# EAGLE design tempcontrol (EAGLE 6.4)
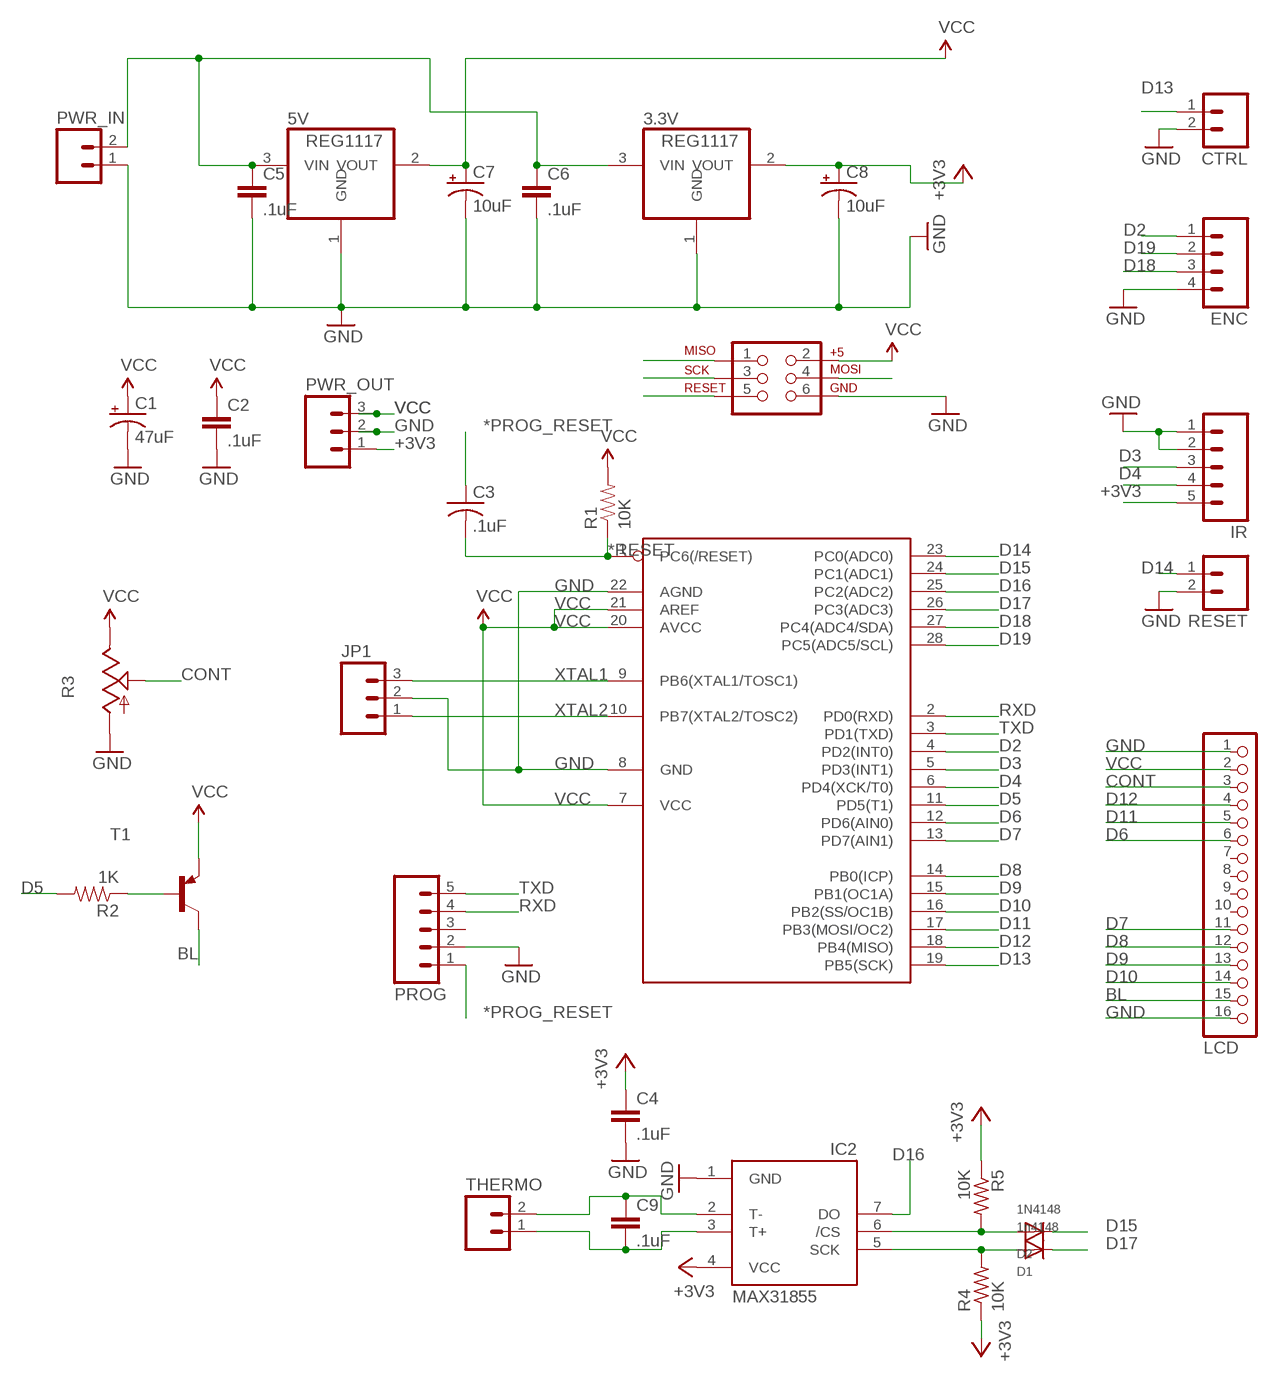
[diagram p0: schematic, sheet 1]

## Parts
3.3V  REG1117  [SOT223]
5V  REG1117  [SOT223]
C1  47uF  CAP_POLPTH2  [CPOL-RADIAL-10UF-25V]
C2  .1uF  CAP0805  [0805]
C3  .1uF  C-USC0805  [C0805]
C4  .1uF  CAP0805  [0805]
C5  .1uF  CAP0805  [0805]
C6  .1uF  CAP0805  [0805]
C7  10uF  CAP_POL3528  [EIA3528]
C8  10uF  CAP_POL3528  [EIA3528]
C9  .1uF  CAP0805  [0805]
CTRL  M02LOCK  [1X02_LOCK]
D1  1n4148  DIODESOD-323F  [SOD-323F]
D2  1N4148  DIODESOD-323F  [SOD-323F]
ENC  M04LOCK  [1X04_LOCK]
IC1  MEGA8-P  [DIL28-3]
IC2  MAX31855  MAX6675  [SO08]
IR  M05LOCK  [1X05_LOCK]
JP1  M03LOCK  [1X03_LOCK]
JP7  LCD  PINHD-1X16  [1X16]
PROG  PROG  M05LOCK  [1X05_LOCK]
PWR_IN  M02LOCK  [1X02_LOCK]
PWR_OUT  M03LOCK  [1X03_LOCK]
R1  10K  RESISTOR0805-RES  [0805]
R2  1K  RESISTOR0805-RES  [0805]
R3  TRIM_US-B64Y  [B64Y]
R4  10K  R-US_R0805  [R0805]
R5  10K  R-US_R0805  [R0805]
RESET  M02LOCK  [1X02_LOCK]
T1  2N3906-PNP-TO92-EBC  [TO92-EBC]
THERMO  M02LOCK  [1X02_LOCK]
U$1  AVR_SPI_PRG_6NS  [2X3-NS]

## Nets
*PROG_RESET: C3.1 PROG.1
*RESET: C3.2 IC1.1(PC6(/RESET)) R1.1 U$1.5
+3V3: 3.3V.2(VOUT) C4.1 C8.A(+) IC2.4(VCC) IR.5 PWR_OUT.1 R4.1 R5.1
BL: JP7.15 T1.C
CONT: JP7.3 R3.S
CS: D2.A IC2.6(/CS) R5.2
D2: ENC.1 IC1.4(PD2(INT0))
D3: IC1.5(PD3(INT1)) IR.3
D4: IC1.6(PD4(XCK/T0)) IR.4
D5: IC1.11(PD5(T1)) R2.2
D6: IC1.12(PD6(AIN0)) JP7.6
D7: IC1.13(PD7(AIN1)) JP7.11
D8: IC1.14(PB0(ICP)) JP7.12
D9: IC1.15(PB1(OC1A)) JP7.13
D10: IC1.16(PB2(SS/OC1B)) JP7.14
D11: IC1.17(PB3(MOSI/OC2)) JP7.5 U$1.4
D12: IC1.18(PB4(MISO)) JP7.4 U$1.1
D13: CTRL.1 IC1.19(PB5(SCK)) U$1.3
D14: IC1.23(PC0(ADC0)) RESET.1
D15: D2.C IC1.24(PC1(ADC1))
D16: IC1.25(PC2(ADC2)) IC2.7(DO)
D17: D1.C IC1.26(PC3(ADC3))
D18: ENC.3 IC1.27(PC4(ADC4/SDA))
D19: ENC.2 IC1.28(PC5(ADC5/SCL))
GND: 3.3V.1(GND) 5V.1(GND) C1.2(-) C2.2 C4.2 C5.2 C6.2 C7.C(-) C8.C(-) CTRL.2 ENC.4 IC1.8(GND) IC1.22(AGND) IC2.1(GND) IR.1 IR.2 JP1.2 JP7.1 JP7.16 PROG.2 PWR_IN.1 PWR_OUT.2 R3.A RESET.2 U$1.6
N$7: R2.1 T1.B
POS_IN: 3.3V.3(VIN) 5V.3(VIN) C5.1 C6.1 PWR_IN.2
RXD: IC1.2(PD0(RXD)) PROG.4
SCK: D1.A IC2.5(SCK) R4.2
T+: C9.2 IC2.3(T+) THERMO.1
T-: C9.1 IC2.2(T-) THERMO.2
TXD: IC1.3(PD1(TXD)) PROG.5
VCC: 5V.2(VOUT) C1.1(+) C2.1 C7.A(+) IC1.7(VCC) IC1.20(AVCC) IC1.21(AREF) JP7.2 PWR_OUT.3 R1.2 R3.E T1.E U$1.2
XTAL1: IC1.9(PB6(XTAL1/TOSC1)) JP1.3
XTAL2: IC1.10(PB7(XTAL2/TOSC2)) JP1.1
Unconnected: JP7.7 JP7.8 JP7.9 JP7.10 PROG.3

## Library data of the parts
3.3V 5V = mylib:REG1117: 800mA and 1A Low Dropout (LDO) Positive Regulator 1.8V, 2.5V, 2.85V, 3.3V, 5V, and Adj
C1 C7 C8 = SparkFun:CAP_POL: Capacitor Polarized These are standard SMD and PTH capacitors. Normally 10uF, 47uF, and 100uF in electrolytic and tantalum varieties. Always verify the external diameter of the through hole cap, it varies with capacity, voltage, and manufacturer. The EIA devices should be standard.
C2 C4-C6 C9 = SparkFun:CAP: Capacitor Standard 0603 ceramic capacitor, and 0.1" leaded capacitor.
C3 = adafruit:C-US: CAPACITOR, American symbol
CTRL PWR_IN RESET THERMO = SparkFun:M02: Header 2 Standard 2-pin 0.1" header. Use with straight break away headers (SKU : PRT-00116), right angle break away headers (PRT-00553), swiss pins (PRT-00743), machine pins (PRT-00117), and female headers (PRT-00115). Molex polarized connector foot print use with SKU : PRT-08233 with associated crimp pins and housings.
D1 D2 = adafruit:DIODE: Diode SMADIODE - SMA Surface Mount Package 20V 1A Schottky Diode Digikey: 641-1014-6-ND DO-1N4148 - Through Hole Small Current Diode SOD-123 20V 1 A (.5mV Vf) Schottky Diode - Digikey: MBRX120TPMSCT-ND SOD-323 10V 570mA (.38mV Vf, 3ns) Schottky Diode - Digikey: ZLLS410CT-ND SOD-523 30V 30mA Schottky Diode (RB751S-40TE61) - Digikey: RB751S-40TE61CT-ND SOT23-R/W - SOT23 Package (R = Solder Paste/Reflow Ovens, W = Hand-Soldering) BAT54Film 40V 300mA - Digikey: 497-7162-1-ND
ENC = SparkFun:M04: Header 4 Standard 4-pin 0.1" header. Use with straight break away headers (SKU : PRT-00116), right angle break away headers (PRT-00553), swiss pins (PRT-00743), machine pins (PRT-00117), and female headers (PRT-00115). Molex polarized connector foot print use with SKU : PRT-08231 with associated crimp pins and housings. 1MM SMD Version SKU: PRT-10208
IC1 = atmel1:MEGA8-P: MICROCONTROLLER 8 Kbytes FLASH 1 kbytes SRAM 512 bytes EEPROM USART 4-channel 10 bit ADC 2-channel 8 bit ADC
IC2 = adafruit:MAX6675
IR PROG = SparkFun:M05: Header 5 Standard 5-pin 0.1" header. Use with straight break away headers (SKU : PRT-00116), right angle break away headers (PRT-00553), swiss pins (PRT-00743), machine pins (PRT-00117), and female headers (PRT-00115). Molex polarized connector foot print use with SKU : PRT-08230 with associated crimp pins and housings.
JP1 PWR_OUT = SparkFun:M03: Header 3 Standard 3-pin 0.1" header. Use with straight break away headers (SKU : PRT-00116), right angle break away headers (PRT-00553), swiss pins (PRT-00743), machine pins (PRT-00117), and female headers (PRT-00115). Molex polarized connector foot print use with SKU : PRT-08232 with associated crimp pins and housings.
JP7 = pinhead:PINHD-1X16: PIN HEADER
R1 R2 = SparkFun:RESISTOR: Resistor Basic schematic elements and footprints for 0603, 1206, and PTH resistors.
R3 = pot:TRIM_US-: POTENTIOMETER
R4 R5 = adafruit:R-US_: RESISTOR, American symbol
T1 = transistor-neu-to92:*-PNP-: PNP Transistror
U$1 = SparkFun:AVR_SPI_PRG_6: AVR ISP 6 Pin This is the reduced ISP connector for AVR programming. Common on Arduino. This footprint will take up less PCB space and can be used with a 10-pin to 6-pin adapter such as SKU: BOB-08508

## Board
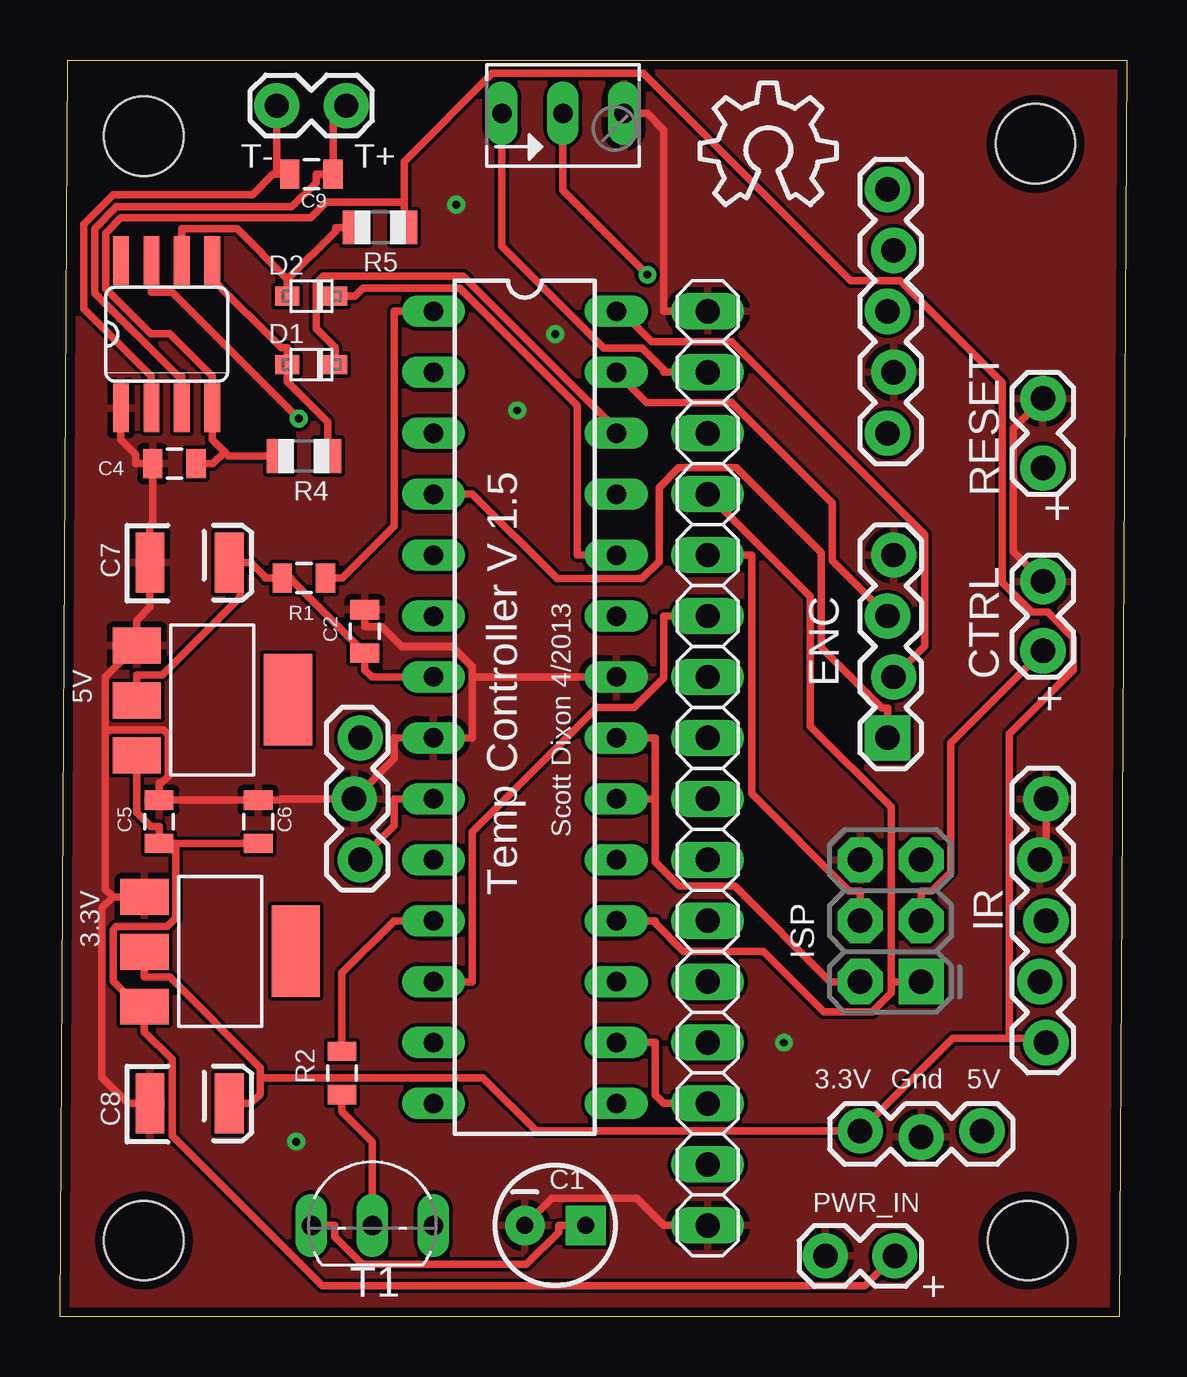
[diagram p1: board, top side]
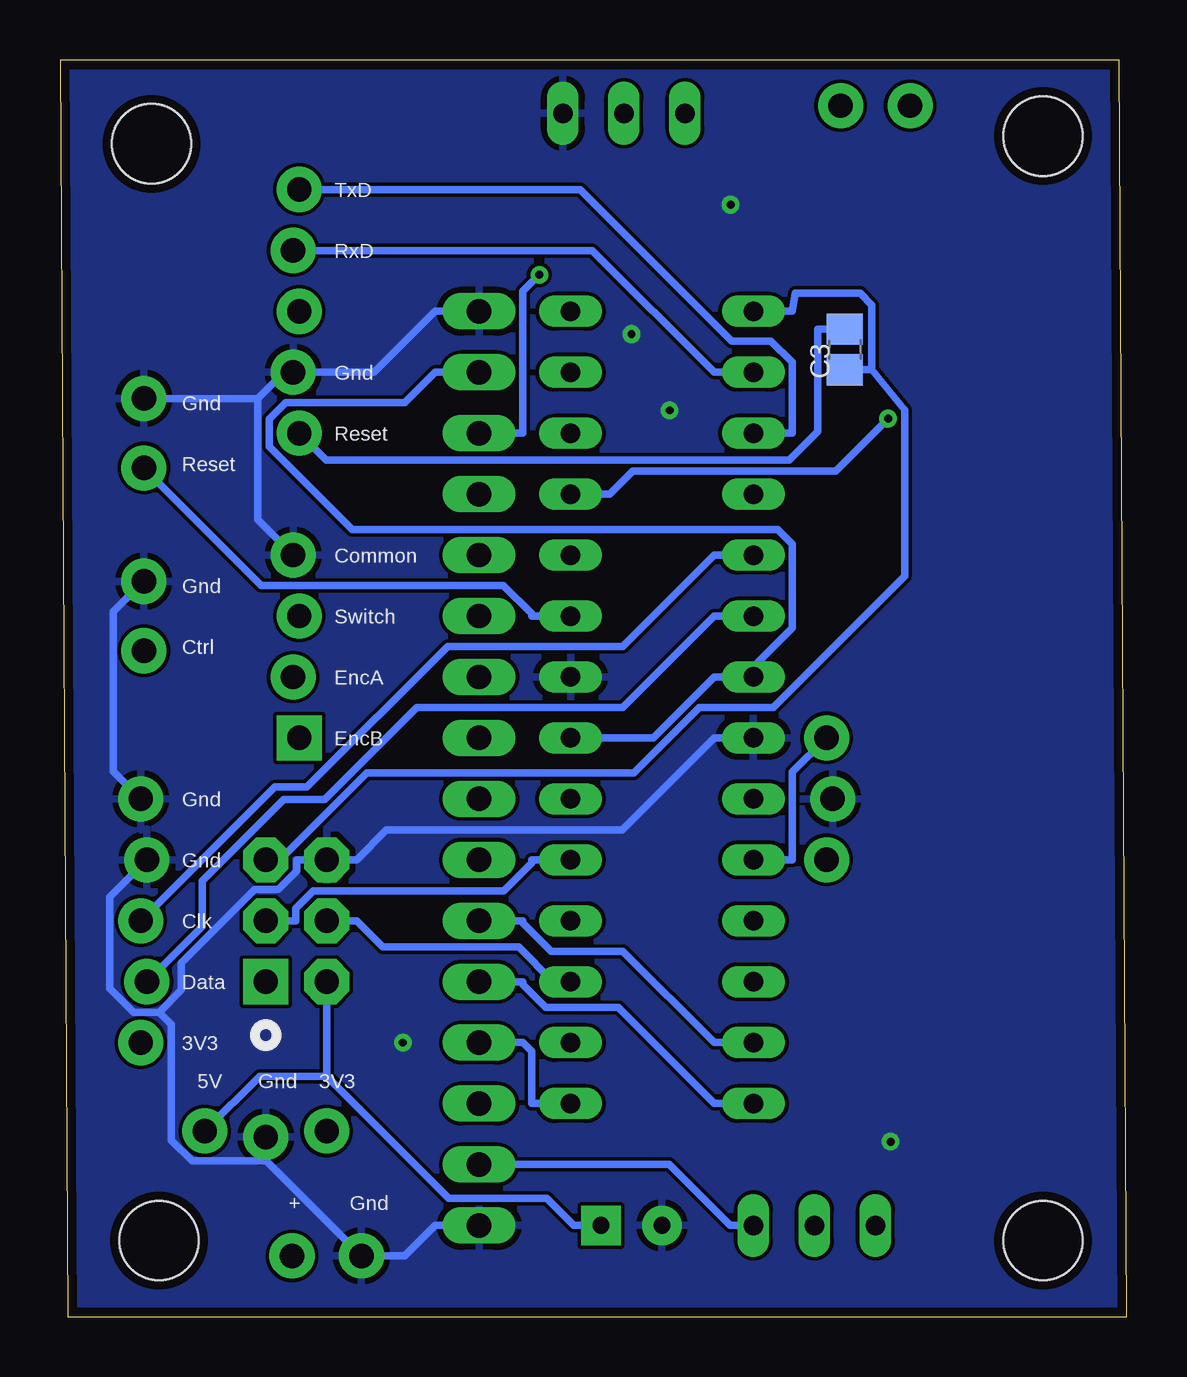
[diagram p2: board, bottom side, seen from below]

Size 44.45 x 52.39 mm. Coordinates in mm from the lower left corner, seen from the top.
Outline: 0.32,52.39 44.45,52.39 44.13,0 0,0 0.32,52.39
Copper layers (1*16): Top 0.0356mm / dielectric 1.5011mm / Bottom 0.0356mm
Design rules "default": minimum track width 12mil, minimum drill 13mil, track to track 6mil, track to pad 6mil, pad to pad 6mil, via to via 6mil, smd to smd 6mil, copper to edge 15mil, drill to drill 6mil, minimum pad ring 10mil, minimum via ring 8mil, stop-mask expansion 4mil, vias tented up to drill 0mil, thermal gap 10mil

### Footprints (pad centres in the part's own frame; a part is rotated, then mirrored left to right if it is on the bottom)
SOT223 = smd 1.499 x 2.007: 1 -2.261,-3.15; 2 0.025,-3.15; 3 2.311,-3.15 | smd 3.81 x 2.007: 4 0,3.15
CPOL-RADIAL-10UF-25V = drill 0.7 pad 1.651 square: 1 1.27,0 | drill 0.7 pad 1.651: 2 -1.27,0
0805 = smd 0.8 x 1.2: 1 -0.9,0; 2 0.9,0
C0805 = smd 1.3 x 1.5: 1 -0.85,0; 2 0.85,0
EIA3528 = smd 1.2 x 2.5: A 1.65,0; C -1.65,0
1X02_LOCK = drill 1.016 pad 1.88: 1 -0.178,0; 2 2.718,0
SOD-323F = smd 1 x 0.8: A -1,0; C 1,0
1X04_LOCK = drill 1.016 pad 1.88 square: 1 0,0.127 | drill 1.016 pad 1.88: 2 2.54,-0.127; 3 5.08,0.127; 4 7.62,-0.127
DIL28-3 = drill 0.813 long: 1 -16.51,-3.81; 2 -13.97,-3.81; 3 -11.43,-3.81; 4 -8.89,-3.81; 5 -6.35,-3.81; 6 -3.81,-3.81; 7 -1.27,-3.81; 8 1.27,-3.81; 9 3.81,-3.81; 10 6.35,-3.81; 11 8.89,-3.81; 12 11.43,-3.81; 13 13.97,-3.81; 14 16.51,-3.81; 15 16.51,3.81; 16 13.97,3.81; 17 11.43,3.81; 18 8.89,3.81; 19 6.35,3.81; 20 3.81,3.81; 21 1.27,3.81; 22 -1.27,3.81; 23 -3.81,3.81; 24 -6.35,3.81; 25 -8.89,3.81; 26 -11.43,3.81; 27 -13.97,3.81; 28 -16.51,3.81
SO08 = smd 0.66 x 2.032: 1 -1.905,-3.073; 2 -0.635,-3.073; 3 0.635,-3.073; 4 1.905,-3.073; 5 1.905,3.073; 6 0.635,3.073; 7 -0.635,3.073; 8 -1.905,3.073
1X05_LOCK = drill 1.016 pad 1.88: 1 0,0.127; 2 2.54,-0.127; 3 5.08,0.127; 4 7.62,-0.127; 5 10.16,0.127
1X03_LOCK = drill 1.016 pad 1.88: 1 0,0.127; 2 2.54,-0.127; 3 5.08,0.127
1X16 = drill 1.016 long: 1 -19.05,0; 2 -16.51,0; 3 -13.97,0; 4 -11.43,0; 5 -8.89,0; 6 -6.35,0; 7 -3.81,0; 8 -1.27,0; 9 1.27,0; 10 3.81,0; 11 6.35,0; 12 8.89,0; 13 11.43,0; 14 13.97,0; 15 16.51,0; 16 19.05,0
B64Y = drill 0.813 long: A 2.54,0; E -2.54,0; S 0,0
R0805 = smd 1.1 x 1.4: 1 -1,0; 2 1,0
TO92-EBC = drill 0.813 long: B 0,-1.27; C 2.54,-1.27; E -2.54,-1.27
2X3-NS = drill 1.016 pad 1.88 square: 1 -2.54,-1.27 | drill 1.016 pad 1.88 octagon: 2 -2.54,1.27; 3 0,-1.27; 4 0,1.27; 5 2.54,-1.27; 6 2.54,1.27
STAND-OFF = hole 3.302: 0,0

### Placement (x,y rotation side)
3.3V  6.67,15.24 270 top
5V  6.35,25.72 270 top
C1  20.64,3.81 0 top
C2  12.7,28.57 90 top
C3  11.75,40.32 270 bottom
C4  4.76,35.56 180 top
C5  4.13,20.64 90 top
C6  8.25,20.64 90 top
C7  5.4,31.43 0 top
C8  5.4,8.89 0 top
C9  10.48,47.62 0 top
CTRL  40.96,27.94 90 top
D1  10.48,39.69 0 top
D2  10.48,42.55 0 top
ENC  34.61,24.13 90 top
IC1  19.37,25.4 270 top
IC2  4.45,40.96 0 top
IR  40.96,21.59 270 top
JP1  12.38,24.13 270 top
JP7  26.99,22.86 270 top
PROG  34.61,36.83 90 top
PWR_IN  32.07,2.54 0 top
PWR_OUT  33.34,7.62 0 top
R1  10.16,30.8 180 top
R2  11.75,10.16 90 top
R3  20.95,50.16 0 top
R4  10.16,35.88 0 top
R5  13.33,45.4 180 top
RESET  40.96,35.56 90 top
T1  13.02,5.08 0 top
THERMO  11.75,50.48 180 top
U$1  34.61,16.51 90 top
U$2  [OSHW_8X200_NOTEXT]  26.67,46.35 0 top
U$3  [STAND-OFF]  40.64,48.89 0 top
U$4  [STAND-OFF]  40.32,3.18 0 top
U$5  [STAND-OFF]  3.49,3.18 0 top
U$6  [STAND-OFF]  3.49,49.21 0 top

### Tracks (layer width: path | path; a pad name or v marks a point on that pad's centre or on a via)
*PROG_RESET
  Bottom 0.305: C3.1 12.87,41.17 12.87,36.91 14.06,35.71 33.36,35.71 PROG.1
*RESET
  Top 0.305: IC1.1 13.93,41.91 13.93,32.96 11.76,30.8 R1.1
  Bottom 0.305: 10.63,39.47 9.26,37.79 9.26,30.87 14.73,25.4 17.81,25.4 20.54,22.66 31.67,22.66 35.29,19.05 U$1.5 | IC1.1 13.93,41.91 13.81,42.66 11.12,42.66 10.63,42.17 10.63,39.47 | 10.63,39.47 11.06,39.47 C3.2
+3V3
  Top 0.305: 14.33,46.47 R5.1 | 39.55,11.6 39.55,24.29 42.23,26.97 42.23,28.3 41.15,29.37 40.48,29.37 39.26,30.6 39.26,38.93 35.01,43.18 32.94,43.18 24.29,51.83 18.01,51.83 14.33,48.15 14.33,46.47 | 14.33,46.47 11.1,46.47 10.44,45.81 2.54,45.81 1.9,45.17 1.9,42.87 3.79,40.98 4.57,40.98 6.35,39.2 IC2.4 6.35,36.56 6.86,36.05 | 6.86,36.05 7.04,35.88 8.31,35.88 R4.1 | 6.86,36.05 6.37,35.56 C4.1 | 8.34,9.97 8.34,10.39 4.57,14.16 3.52,14.16 3.3V.2 | 8.34,9.97 8.34,9.28 7.95,8.89 C8.A | 8.34,9.97 17.62,9.97 19.84,7.75 PWR_OUT.1 37.19,11.6 39.55,11.6 | 39.55,11.6 40.91,11.6 IR.5
BL
  Bottom 0.305: T1.C 16.52,3.81 19.06,6.35 JP7.15
CONT  (via drill 0.33 pad 0.74)
  Top 0.305: R3.S 20.95,46.95 v24.47,43.43
  Bottom 0.305: JP7.3 25.16,36.83 25.16,42.75 v24.47,43.43
CS
  Top 0.305: 9.48,43.25 7.38,45.35 5.08,45.35 IC2.6 | D2.A 9.48,43.25 | R5.2 11.48,45.4 11.48,45.25 9.48,43.25
D2
  Top 0.305: ENC.1 34.48,25.38 34.25,25.38 31.72,27.9 31.72,31.86 28.19,35.39 25.79,35.39 24.96,34.56 24.96,31.48 24.24,30.76 20.71,30.76 17.18,34.29 IC1.4
D3
  Bottom 0.305: IC1.5 17.18,31.75 20.99,27.94 28.3,27.94 34.16,22.08 35.51,22.08 IR.3
D4
  Bottom 0.305: IR.4 38.52,16.28 38.52,18.17 35.13,21.57 33.41,21.57 29.58,25.4 20.99,25.4 17.18,29.21 IC1.6
D5
  Top 0.305: IC1.11 13.93,16.51 11.75,14.33 R2.2
D6
  Top 0.305: JP7.6 25.16,29.21 25.16,26.62 23.93,25.4 22.37,25.4 17.18,20.21 17.18,13.97 IC1.12
D7
  Bottom 0.305: JP7.11 25.16,16.51 25.16,16.41 23.99,15.24 20.99,15.24 17.18,11.43 IC1.13
D8
  Bottom 0.305: JP7.12 25.16,13.97 25.16,13.86 24.2,12.9 21.2,12.9 17.18,8.89 IC1.14
D9
  Bottom 0.305: JP7.13 25.16,11.43 24.8,11.08 24.8,8.89 IC1.15
D10
  Top 0.305: JP7.14 25.16,8.89 24.8,9.25 24.8,11.43 IC1.16
D11
  Top 0.305: JP7.5 28.82,31.75 28.82,21.81 32.87,17.76 33.34,17.76 U$1.4
  Bottom 0.305: U$1.4 32.09,16.51 31,15.42 25.34,15.42 23.89,13.97 IC1.17
D12
  Top 0.305: JP7.4 31.26,30.01 31.26,24.61 34.63,21.24 34.63,13.97 | IC1.18 24.8,16.51 24.8,16.41 25.97,15.24 29.31,15.24 31.83,12.72 33.85,12.72 34.63,13.5 34.63,13.97 | U$1.1 34.63,13.97
D13
  Top 0.305: U$1.3 35.88,17.76 36.34,17.76 37.12,18.53 37.12,23.93 CTRL.1
  Bottom 0.305: U$1.3 34.63,16.51 34.63,17.03 33.9,17.76 25.97,17.76 24.8,18.92 24.8,19.05 IC1.19
D14
  Bottom 0.305: IC1.23 24.8,29.21 24.8,29.31 25.97,30.48 36.06,30.48 RESET.1
D15
  Top 0.305: D2.C 12.28,42.55 12.62,42.88 16.65,42.88 21.55,37.98 21.55,31.75 IC1.24
D16  (via drill 0.33 pad 0.74)
  Top 0.305: v9.94,37.44 4.68,42.71 3.81,42.71 IC2.7
  Bottom 0.305: v9.94,37.44 12.13,35.25 20.59,35.25 21.55,34.29 IC1.25
D17
  Top 0.305: D1.C 11.48,40.39 10.67,41.2 10.67,43.08 10.98,43.38 16.79,43.38 23.18,37 IC1.26
D18
  Top 0.305: IC1.27 24.45,38.1 28,38.1 32.18,33.92 32.18,31.51 ENC.3
D19
  Top 0.305: IC1.28 23.38,41.91 24.65,40.64 27.99,40.64 36.03,32.6 36.03,27.96 ENC.2
GND  (via drill 0.33 pad 0.74)
  Top 0.305: 1.89,24.46 1.89,26.67 5V.1 3.2,29.03 3.75,29.58 C7.C 3.75,32.99 3.86,33.1 C4.2 3.16,35.56 3.16,35.95 2.54,36.56 IC2.1 | R3.A 24.46,50.16 25.16,49.47 25.16,41.91 JP7.1 | 2.21,17.5 1.89,17.82 1.89,24.46 | 1.89,24.46 4.33,24.46 4.51,24.28 4.51,22.53 4.22,22.24 4.13,22.24 C5.2 C6.2 9.16,21.54 9.21,21.59 JP1.2 13.93,23.27 13.93,24.13 IC1.8 17.18,24.13 17.18,26.67 | 3.3V.1 2.21,17.5 | C8.C 2.84,8.89 1.75,9.98 1.75,17.04 2.21,17.5 | JP7.16 25.16,3.81 24.03,4.94 20.5,4.94 C1.2 | CTRL.2 39.71,31.9 39.71,37.03 RESET.2 | 17.18,26.67 17.18,27.11 16.35,27.94 14.24,27.94 13.4,28.77 12.7,28.77 C2.2 | 17.18,26.67 21.55,26.67 IC1.22 | IR.2 41.08,19.3 IR.1
  Bottom 0.305: 36.21,38.28 36.21,33.22 ENC.4 | 36.21,38.28 35.11,39.37 PROG.2 31.36,39.37 28.82,41.91 JP7.1 | RESET.2 36.21,38.28 | IC1.8 17.18,24.13 21.02,20.3 30.85,20.3 32.09,19.05 U$1.6 33.89,19.05 34.58,19.05 34.58,18.58 35.36,17.8 36.34,17.8 39.39,14.76 39.39,13.63 40.32,12.7 | 35.88,6.5 35.85,6.5 PWR_IN.1 30.09,2.54 28.82,3.81 JP7.16 | 40.32,12.7 39.81,12.18 39.81,7.36 38.95,6.5 35.88,6.5 | 35.88,6.5 PWR_OUT.2 | 40.32,12.7 41.39,12.7 42.37,13.68 42.37,17.51 IR.2 | IR.1 42.23,22.73 42.23,29.39 CTRL.2
  other vias: 30.16,11.43 9.84,7.3 16.51,46.35 20.64,40.96 19.05,37.78
  pour Bottom: 0.32,52.39 44.13,52.39 44.13,0 0.32,0
  pour Top: 0.32,52.39 44.13,52.39 44.13,-0.32 0.32,-0.32
N$7
  Top 0.305: R2.1 11.75,8.55 13.02,7.29 T1.B
POS_IN
  Top 0.305: 4.83,19.74 C5.1 4.13,20.44 3.78,20.44 3.2,21.02 3.2,22.35 5V.3 | C6.1 4.83,19.74 | 3.52,12.67 2.21,13.97 2.21,16.12 2.35,16.27 4.47,16.27 4.83,16.62 4.83,19.74 | 3.52,12.67 3.52,11.87 4.67,10.72 4.67,7.54 10.92,1.29 33.54,1.29 PWR_IN.2 | 3.3V.3 3.52,12.67
RXD
  Bottom 0.305: IC1.2 17.18,39.37 22.26,44.45 PROG.4
SCK
  Top 0.305: R4.2 11.16,36.88 11.16,37.3 9.48,38.98 D1.A 9.48,40.39 9.21,40.39 6.35,43.26 IC2.5
T+
  Top 0.305: IC2.3 5.08,39.2 4.92,39.2 1.45,42.68 1.45,45.36 2.35,46.27 9.67,46.27 10.67,47.27 10.67,47.62 C9.2 11.38,49.93 THERMO.1
T-
  Top 0.305: 9.03,47.62 8.87,47.62 8.02,46.78 2.21,46.78 0.99,45.55 0.99,42.02 3.81,39.2 IC2.2 | C9.1 9.03,47.62 | THERMO.2 9.03,47.62
TXD
  Bottom 0.305: IC1.3 13.93,36.83 13.93,39.78 14.83,40.68 16.46,40.68 22.77,46.99 PROG.5
VCC
  Top 0.305: R3.E 18.41,44.62 22.65,40.39 24.25,40.39 25.16,39.48 25.16,39.37 JP7.2 | IC1.7 13,26.67 12.7,26.97 C2.1 9.61,30.76 9.61,30.8 R1.2 8.56,30.8 8.56,30.83 7.95,31.43 7.5,31.43 | T1.E 11.44,3.81 11.44,3.33 12.59,2.18 19.43,2.18 20.78,3.53 20.78,3.81 C1.1 | IC1.21 24.8,24.13 24.8,21.59 | IC1.20 24.8,21.59 | U$1.2 32.09,13.97 28.11,17.96 25.81,17.96 24.8,18.96 24.8,21.59 | 5V.2 3.2,26.75 4.25,26.75 7.5,29.99 7.5,31.43 | C7.A 7.5,31.43
  Bottom 0.305: JP7.2 28.82,39.37 30.09,38.1 35.04,38.1 35.73,37.41 35.73,36.27 32.28,32.82 14.53,32.82 13.93,32.21 13.93,28.71 15.98,26.67 | 15.98,26.67 17.18,26.67 19.72,24.13 IC1.21 | IC1.7 15.98,26.67 | C1.1 23.04,3.81 24.17,4.94 28.24,4.94 33.34,10.03 | 33.34,10.03 36.13,10.03 PWR_OUT.3 | 33.34,10.03 33.34,12.72 U$1.2
XTAL1
  Top 0.305: IC1.9 13.93,21.59 13.93,20.47 JP1.3
XTAL2
  Bottom 0.305: IC1.10 13.93,19.05 13.93,22.71 JP1.1

### Text on the board
tNames: T- | T+ | Temp Controller V 1.5 | + | + | Scott Dixon 4/2013 | ISP | 3.3V | Gnd | 5V | +
bNames: TxD | RxD | Gnd | Gnd | Reset | Reset | Common | Gnd | Switch | Ctrl | EncA | EncB | Gnd | Gnd | Clk | Data | 3V3 | 3V3 | Gnd | 5V | Gnd | +